# Altium project X2E Reference Sensor.PrjPcb (part 2 of 3)

## Sheet POWER.SchDoc: X2E Reference Sensor
size A3; PageSetup: Record=PageOptions|CenterHorizontal=True|CenterVertical=True|PrintScale=1.00|XCorrection=1.00|YCorrection=1.00|PrintKind=0|BorderSize=5000000|LeftOffset=0|BottomOffset=0|Orientation=2|PaperLength=1000|PaperWidth=1000|Scale=100|PaperSource=15|PrintQuality=600|MediaType=1|DitherType=10|PaperKind=Letter|PrintScaleMode=1; CompanyName: MatchX GmbH; Engineer: PSB; Organization: MatchX GmbH; DocumentNumber: 5; Revision: 1.2; SheetNumber: 5; SheetTotal: 9
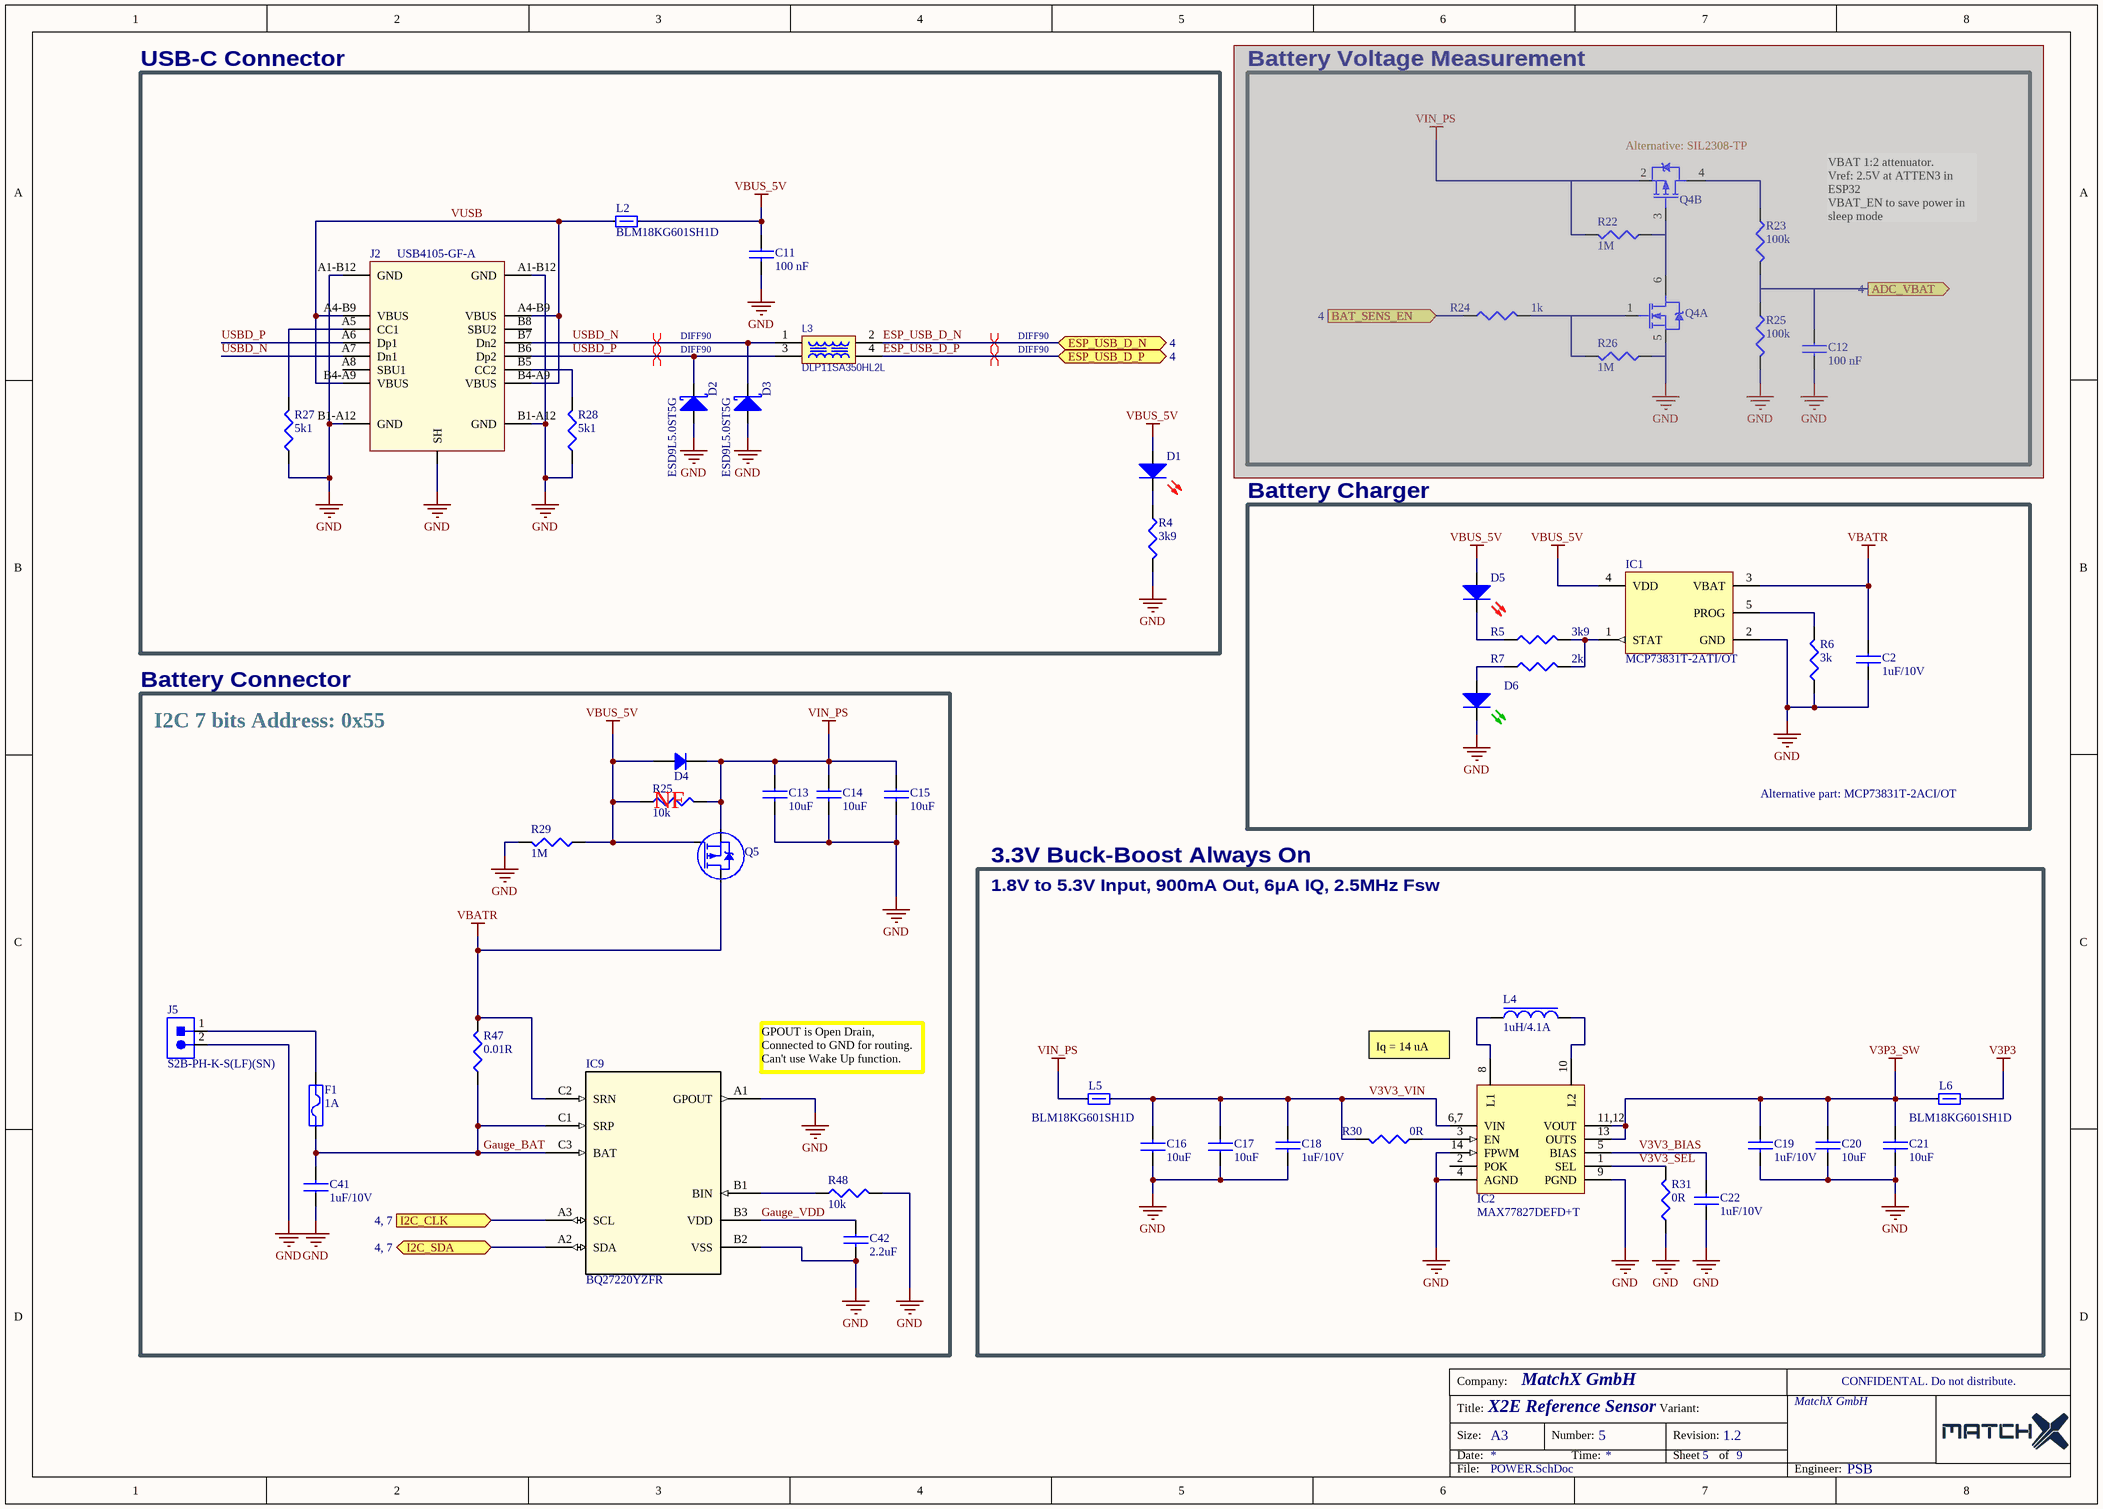
[diagram p6: POWER.SchDoc]

### Parts
(Parts that share a designator on the sheet are numbered #1, #2 ... from top to bottom, then left to right.)
C2  1uF/10V  [C0402]
C11  100 nF  [C0402]
C12  100 nF  [C0402]  (masked out: inside a compile mask, not in the netlist)
C13  10uF  [C0805]
C14  10uF  [C0805]
C15  10uF  [C0805]
C16  10uF  [C0805]
C17  10uF  [C0805]
C18  1uF/10V  [C0402]
C19  1uF/10V  [C0402]
C20  10uF  [C0805]
C21  10uF  [C0805]
C22  1uF/10V  [C0402]
C41  1uF/10V  [C0402]
C42  2.2uF  [C0402]
D1  150060RS75000  [LED0603]  (value not drawn)
D2  ESD9L5.0ST5G  [SOD-923]
D3  ESD9L5.0ST5G  [SOD-923]
D4  Diode_US1GWF-7  [sod123f]  (value not drawn)
D5  LTST-S270KRKT  [LED0603_RA]  (value not drawn)
D6  LTST-S270KGKT  [LED0603_RA]  (value not drawn)
F1  Current Rating: 1A  [F1206]  (hidden comment: FUSE-SF-1206S100-2)
IC1  MCP73831T-2ATI/OT  [SOT23-5]
IC2  MAX77827DEFD+T  [14-FC2QFN]
IC9  BQ27220YZFR  [IC_BQ27421YZFR-G1A]
J2  Manufacturer Part Number: USB4105-GF-A  [TYPE-CF-16P-RAT-L7.3]  (hidden comment: TYPE-CF-16P-RAT-L7.3)
J5  S2B-PH-K-S(LF)(SN)  [CON_S2B-PH-K-S]
L2  BLM18KG601SH1D  [L0603]
L3  DLP11SA350HL2L  [DLP11SA350HL2L]
L4  1uH/4.1A  [L252020]
L5  BLM18KG601SH1D  [L0603]
L6  BLM18KG601SH1D  [L0603]
Q4  DMC2700UDM-7  [SOT23-6]  (value not drawn)  (parts A,B of 2)  (masked out: inside a compile mask, not in the netlist)
Q5  IRLML6401TRPBF  [SOT-23]  (value not drawn)
R4  3k9  [R0603]
R5  3k9  [R0603]
R6  3k  [R0603]
R7  2k  [R0603]
R22#1  1M  [R0402]  (masked out: inside a compile mask, not in the netlist)
R23#2  100k  [R0402]  (masked out: inside a compile mask, not in the netlist)
R24#1  1k  [R0402]  (masked out: inside a compile mask, not in the netlist)
R25#1  100k  [R0402]  (masked out: inside a compile mask, not in the netlist)
R25#2  10k  [R0402]
R26#1  1M  [R0402]  (masked out: inside a compile mask, not in the netlist)
R27  5k1  [R0603]
R28  5k1  [R0603]
R29  1M  [R0402]
R30  0R  [R0402]
R31  0R  [R0402]
R47  0.01R  [R0805]
R48  10k  [R0402]

### Blocks framed on the sheet
USB-C Connector: C11 D1-D3 J2 L2 L3 R4 R27 R28
Battery Voltage Measurement: C12 Q4 R22#1 R23#2 R24#1 R25#1 R26#1
Battery Charger: C2 D5 D6 IC1 R5-R7
3.3V Buck-Boost Always On: C16-C22 IC2 L4-L6 R30 R31

### Ports
ADC_VBAT (out, see 4), BAT_SENS_EN (in, see 4), ESP_USB_D_N (bidir, see 4), ESP_USB_D_P (bidir, see 4), I2C_CLK (in, see 4, 7), I2C_SDA (bidir, see 4, 7)

### Nets
GND: C2.2 C11.2 C13.2 C14.2 C15.2 C16.1 C17.1 C18.2 C19.2 C20.2 C21.2 C22.1 C41.1 C42.2 D2.2(K) D3.2(K) D6.K IC1.2(GND) IC2.4(AGND) IC2.9(PGND) IC2.14(FPWM) IC9.A1(GPOUT) IC9.B2(VSS) J2.A1-B12(GND) J2.B1-A12(GND) J2.SH J5.2 R4.1 R6.1 R27.1 R28.1 R29.2 R31.1 R48.2
V3P3: L6.2
V3P3_SW: C19.1 C20.1 C21.1 IC2.11,12(VOUT) IC2.13(OUTS) L6.1
VBATR: C2.1 IC1.3(VBAT) IC9.C2(SRN) Q5.3(D) R47.2
VBUS_5V: C11.1 D1.A D4.1 D5.A IC1.4(VDD) L2.2 Q5.1(G) R25#2.1 R29.1
VIN_PS: C13.1 C14.1 C15.1 D4.2 L5.1 Q5.2(S) R25#2.2
ESP_USB_D_N: L3.2 ; port ESP_USB_D_N
ESP_USB_D_P: L3.4 ; port ESP_USB_D_P
Gauge_BAT: C41.2 F1.2 IC9.C1(SRP) IC9.C3(BAT) R47.1
Gauge_VDD: C42.1 IC9.B3(VDD)
I2C_CLK: IC9.A3(SCL) ; port I2C_CLK
I2C_SDA: IC9.A2(SDA) ; port I2C_SDA
USBD_N: D3.1(A) J2.A7(Dn1) J2.B7(Dn2) L3.1
USBD_P: D2.1(A) J2.A6(Dp1) J2.B6(Dp2) L3.3
V3V3_BIAS: C22.2 IC2.5(BIAS)
V3V3_SEL: IC2.1(SEL) R31.2
V3V3_VIN: C16.2 C17.2 C18.1 IC2.6,7(VIN) L5.2 R30.2
VUSB: J2.A4-B9(VBUS) J2.B4-A9(VBUS) L2.1
NetD1_K: D1.K R4.2
NetD5_K: D5.K R5.2
NetD6_A: D6.A R7.2
NetF1_1: F1.1 J5.1
NetIC1_1: IC1.1(STAT) R5.1 R7.1
NetIC1_5: IC1.5(PROG) R6.2
NetIC2_3: IC2.3(EN) R30.1
NetIC2_8: IC2.8(L1) L4.1
NetIC2_10: IC2.10(L2) L4.2
NetIC9_B1: IC9.B1(BIN) R48.1
NetJ2_A5: J2.A5(CC1) R27.2
NetJ2_B5: J2.B5(CC2) R28.2

Not connected (* = marked no-connect by the designer): IC2 2(POK); J2 A8(SBU1) B8(SBU2)

### Layout directives
differential pair; differential pair class DIFF90; net class DIFF90: ESP_USB_D_N, ESP_USB_D_P, USBD_N, USBD_P

### Notes on the sheet
- (near Q4) Alternative: SIL2308-TP
- VBAT 1:2 attenuator.
  Vref: 2.5V at ATTEN3 in ESP32
  VBAT_EN to save power in sleep mode
- Battery Connector
- I2C 7 bits Address: 0x55
- Alternative part: MCP73831T-2ACI/OT
- 1.8V to 5.3V Input, 900mA Out, 6μA IQ, 2.5MHz Fsw
- Iq = 14 uA
- (near IC9) GPOUT is Open Drain,
  Connected to GND for routing.
  Can't use Wake Up function.
- Company:
- CONFIDENTAL. Do not distribute.
- Title:
- Size:
- Date:
- A3
- Number:
- Time:
- Variant:
- Revision:
- Sheet
- of
- File:
- Engineer:

### Library data of the parts
C2 C18 C19 C22 C41 = C0402-1uF_10V: CAP, CERM, 1 uF, 10V, +/- 10%, X5R, 0402; Manufacturer Part Number: C0402C105M8PACTU; CompType: Capacitor; Category: Capacitors; Operating Temperature: -55°C ~ 85°C; Package / Case: 0402; RoHS: RoHS Compliant; Temperature Coefficient: X5R; Tolerance: 10%; Voltage - Rated: 10V; MountType: SMT; Technology: Ceramic; Value: 1uF/10V
C11 C12 = C0402-100nF_50V: CAP, CERM, 100 nF, 50V, +/- 10%, X7R, 0402; Manufacturer Part Number: GRM155R71H104KE14J; CompType: Capacitor; Category: Capacitors; Operating Temperature: -55°C ~ 125°C; Package / Case: 0402; RoHS: RoHS Compliant; Temperature Coefficient: X7R; Tolerance: 10%; Voltage - Rated: 50 V; MountType: SMT; Technology: Ceramic; Value: 100 nF
C13-C17 C20 C21 = C0805-10uF_16V: CAP, CERM, 10uF, 16V, +/- 20%, X5R, 0805; Manufacturer Part Number: GRM21BR61C106KE15L; CompType: Capacitor; Category: Capacitors; Operating Temperature: -55°C ~ 85°C; Package / Case: 0805 (2012 Metric); RoHS: RoHS Compliant; Temperature Coefficient: X5R; Tolerance: 20%; Voltage - Rated: 16 V; MountType: SMT; Technology: Ceramic; Value: 10uF
C42 = C0402-2.2uF/10V: CAP, CERM, 2.2uF, 10V, +/- 10%, X5R, 0402; Manufacturer Part Number: GRM155R61A225KE01D; CompType: Capacitor; Category: Capacitors; Operating Temperature: -55°C ~ 85°C; Package / Case: 0402; RoHS: RoHS Compliant; Temperature Coefficient: X5R; Tolerance: 10%; Voltage - Rated: 10V; MountType: SMT; Technology: Ceramic; Value: 2.2uF
D1 = LED_RED_0603: Red 625nm LED Indication - Discrete 2V 0603 (1608 Metric); Manufacturer: Wurth Electronics; Wavelength - Peak: 630nm; Millicandela Rating: 250mcd; Current - Test: 20mA; Viewing Angle: 140°; Lens Style/Size: Rectangle with Flat Top, 1.1mm x 0.7mm; 3D Model: SMCW_0603.igs / SMCW_0603.stp / SMCW_0603.wrl; Lens Type: Clear; Dynamic Catalog: 0603 Rectangle with Flat Top Chip LEDs; Other Names: 732-4978-6; Supplier 1: Digikey; Manufacturer Part Number: 150060RS75000; Stock 1: 11457; Pricing 1: 1=0.14, 50=0.129, 100=0.11, 500=0.095 (USD); ComponentLink1URL: https://datasheet.ciiva.com/29563/150060rs75000-29563040.pdf; ComponentLink1Description: https://datasheet.ciiva.com/29563/150060rs75000-29563040.pdf; Category: Optoelectronics; Packaging: Digi-Reel®; Color: Red; Wavelength - Dominant: 625nm; Voltage - Forward (Vf) (Typ): 2V; Package / Case: 0603 (1608 Metric); Size / Dimension: 1.60mm L x 0.80mm W; Mounting Type: Surface Mount; ComponentLink2URL: https://datasheet.ciiva.com/29279/759428-da-01-en-chipled-0603-w-kl-rot-150060rs75000-29279196.pdf; ComponentLink2Description: https://datasheet.ciiva.com/29279/759428-da-01-en-chipled-0603-w-kl-rot-150060rs75000-29279196.pdf; Supplier Part Number 1: 732-4978-6-ND; Standard Package: 1; Family: LED Indication - Discrete; Series: WL-SMCW; Height: 0.70mm; Luminous Flux @ Current - Test: -
D2 D3 = TVSUni_ESD9L5.0ST5G: TVS DIODE 5V 9.8V SOD923; Manufacturer: ON Semiconductor; Capacitance: 0.9pF; Direction: Unidirectional; Number of Unidirectional Channels: 1; Min Breakdown Voltage: 5.4V; Power Line Protection: No; Leakage Current: 1uA; Element Configuration: Single; Peak Pulse Current: 1A; Reverse Breakdown Voltage: 5.8V; Peak Pulse Power: 150mW; ESD Protection: Yes; Test Current: 1mA; Supplier 1: Digi-Key; Supplier Part Number 1: ESD9L5.0ST5GOSCT-ND; Manufacturer Part Number: ESD9L5.0ST5G; Stock 1: 56991; Pricing 1: 1=0,36000, 10=0,29700, 100=0,15730, 500=0,10350, 1000=0,07038 (USD); RoHS: Yes; Case/Package: SOD-923-2; Number of Pins: 2; Contact Plating: Tin,Matte; Min Operating Temperature: -55°C; Max Operating Temperature: 150°C; Package Quantity: 1; Packaging: Tape and Reel; Clamping Voltage: 9.8V; Reverse Standoff Voltage: 5V; Working Voltage: 5V; Composition: Zener; Number of Elements: 1; Operating Supply Voltage: 5V; Max Surge Current: 1A; Breakdown Voltage: 5.4V; Number of Channels: 1; Polarity: Unidirectional; Termination: SMD/SMT; Max Reverse Leakage Current: 1uA; Max Breakdown Voltage: 5.4V; Number of Lines: 1; Power Dissipation: 150mW; Length: 0.8mm; Height: 0.4mm; Depth: 0.6mm; Width: 0.65mm; Radiation Hardening: No; Lead Free: Lead Free; REACH SVHC: No SVHC; Halogen Free: Halogen Free; ComponentLink1URL: https://datasheet.ciiva.com/15143/getdatasheetpartid-185186-15143896.pdf?src-supplier=Verical; ComponentLink1Description: https://datasheet.ciiva.com/15143/getdatasheetpartid-185186-15143896.pdf?src-supplier=Verical; ComponentLink2URL: https://datasheet.ciiva.com/4510/esd9l-d-4510647.pdf?src-supplier=Mouser; ComponentLink2Description: https://datasheet.ciiva.com/4510/esd9l-d-4510647.pdf?src-supplier=Mouser; ComponentLink3URL: https://datasheet.ciiva.com/3304/esd9l-d-3304011.pdf?src-supplier=Avnet; ComponentLink3Description: https://datasheet.ciiva.com/3304/esd9l-d-3304011.pdf?src-supplier=Avnet; ComponentLink4URL: https://datasheet.ciiva.com/16437/esd9l-d-16437835.pdf?src-supplier=Future+Electronics; ComponentLink4Description: https://datasheet.ciiva.com/16437/esd9l-d-16437835.pdf?src-supplier=Future+Electronics; ComponentLink5URL: https://datasheet.ciiva.com/339/esd9l-d-339853.pdf?src-supplier=Digi-Key; ComponentLink5Description: https://datasheet.ciiva.com/339/esd9l-d-339853.pdf?src-supplier=Digi-Key; ComponentLink6URL: https://datasheet.ciiva.com/339/esd9l-d-339854.pdf?src-supplier=Digi-Key; ComponentLink6Description: https://datasheet.ciiva.com/339/esd9l-d-339854.pdf?src-supplier=Digi-Key; ComponentLink7URL: https://datasheet.ciiva.com/11195/esd9l-d-11195342.pdf?src-supplier=Avnet; ComponentLink7Description: https://datasheet.ciiva.com/11195/esd9l-d-11195342.pdf?src-supplier=Avnet; ComponentLink8URL: https://datasheet.ciiva.com/25958/esd9l-d-25958446.pdf?src-supplier=Avnet+Europe; ComponentLink8Description: https://datasheet.ciiva.com/25958/esd9l-d-25958446.pdf?src-supplier=Avnet+Europe; ComponentLink9URL: https://datasheet.ciiva.com/339/esd9l-d-339855.pdf?src-supplier=Digi-Key; ComponentLink9Description: https://datasheet.ciiva.com/339/esd9l-d-339855.pdf?src-supplier=Digi-Key
D4 = Diode_US1GWF-7: DIODE GEN PURP 400V 1A SOD123F; Manufacturer: Diodes Incorporated; Capacitance @ Vr, F: 9pF @ 4V, 1MHz; Voltage - Forward (Vf) (Max) @ If: 1.25 V @ 1 A; Diode Type: Standard; Manufacturer Part Number: US1GWF-7; Voltage - DC Reverse (Vr) (Max): 400 V; Supplier Device Package: SOD-123F; Supplier Part Number 1: US1GWF-7DICT-ND; Package / Case: SOD-123F; Operating Temperature - Junction: -55°C ~ 150°C
D5 = LED_RED_0603_RA: LED Low-Power Uni-Color Red 639nm 2V 2-Pin Chip LED T/R; Manufacturer: Vishay Lite-On; Viewing Angle: 130°; Lens Color: Colorless; Forward Current: 30mA; Luminous Intensity: 54mcd; Lens Style: Flat,Diffused,Colorless,Rectangular,Clear; Power Rating: 75mW; Dominant Wavelength: 631nm; Test Current: 20mA; Lens Transparency: Clear; Number of Elements: 1; Reverse Voltage: 5V; Lens Size: 0.6mm; Supplier 1: Digikey; Manufacturer Part Number: LTST-S270KRKT; Stock 1: 148097; Pricing 1: 1=0,24, 10=0,133, 100=0,0617, 500=0,05696, 1000=0,04462, 2000=0,04367 (USD); ComponentLink1URL: https://datasheet.ciiva.com/11775/0900766b80dc0b8e-11775445.pdf?src-supplier=Rs; ComponentLink1Description: https://datasheet.ciiva.com/11775/0900766b80dc0b8e-11775445.pdf?src-supplier=Rs; Category: LEDs; Packaging: Tape and Reel; Color: Red; ComponentLink2URL: https://datasheet.ciiva.com/12400/ltst-s270krkt-201849-12400833.pdf?src-supplier=Mouser; ComponentLink2Description: https://datasheet.ciiva.com/12400/ltst-s270krkt-201849-12400833.pdf?src-supplier=Mouser; Supplier Part Number 1: 160-1479-1-ND; Series: -; Height: 0.6mm; RoHS: Yes; Mount: Surface Mount; Case/Package: 0603; Number of Pins: 2; Case Code (Metric): 1608; Case Code (Imperial): 0603; Min Operating Temperature: -55°C; Max Operating Temperature: 85°C; Forward Voltage: 2V; Package Quantity: 4000; Illumination Color: Red; Power Dissipation: 75mW; Wavelength: 639nm; Number of LEDs: 1; Max Power Dissipation: 75mW; Length: 1.6mm; Width: 1.15mm; Depth: 0.6mm; Radiation Hardening: No; Lead Free: Lead Free; RoHS Compliant: Yes; ComponentLink3URL: https://datasheet.ciiva.com/2110/ltst-s270krkt-2110021.pdf?src-supplier=Digikey; ComponentLink3Description: https://datasheet.ciiva.com/2110/ltst-s270krkt-2110021.pdf?src-supplier=Digikey; ComponentLink4URL: https://datasheet.ciiva.com/16387/p-100-ltst-s270krkt-16387507.pdf?src-supplier=Future+Electronics; ComponentLink4Description: https://datasheet.ciiva.com/16387/p-100-ltst-s270krkt-16387507.pdf?src-supplier=Future+Electronics; ComponentLink5URL: https://datasheet.ciiva.com/2110/s-110-ltst-s270krkt-2110023.pdf?src-supplier=Digikey; ComponentLink5Description: https://datasheet.ciiva.com/2110/s-110-ltst-s270krkt-2110023.pdf?src-supplier=Digikey; ComponentLink6URL: https://datasheet.ciiva.com/2110/s-110-ltst-s270krkt-2110022.pdf?src-supplier=Digikey; ComponentLink6Description: https://datasheet.ciiva.com/2110/s-110-ltst-s270krkt-2110022.pdf?src-supplier=Digikey
D6 = LED_GREEN_0603_RA: LED GREEN CLEAR 0603 R/A SMD / LED Uni-Color Green 574nm 2-Pin Chip LED T/R; Manufacturer: Vishay Lite-On; Viewing Angle: 130°; Lens Color: Colorless; Forward Current: 30mA; Forward Voltage: 2V; Power Rating: 75mW; Luminous Intensity: 71mcd; Lens Style: Flat,Diffused,Colorless,Rectangular,Clear; Dominant Wavelength: 571nm; Test Current: 20mA; Number of Elements: 1; Reverse Voltage: 5V; Lens Size: 0.6mm; Supplier 1: Digikey; Manufacturer Part Number: LTST-S270KGKT; Stock 1: 117112; Pricing 1: 1=0,24, 10=0,133, 100=0,0617, 500=0,05696, 1000=0,04462, 2000=0,04367 (USD); ComponentLink1URL: https://datasheet.ciiva.com/2110/ltst-s270kgkt-2110006.pdf?src-supplier=Digikey; ComponentLink1Description: https://datasheet.ciiva.com/2110/ltst-s270kgkt-2110006.pdf?src-supplier=Digikey; Category: LEDs; Packaging: Tape and Reel; Color: Green; ComponentLink2URL: https://datasheet.ciiva.com/11774/0900766b80dc0b88-11774745.pdf?src-supplier=Rs; ComponentLink2Description: https://datasheet.ciiva.com/11774/0900766b80dc0b88-11774745.pdf?src-supplier=Rs; Supplier Part Number 1: 160-1478-1-ND; Series: -; Height: 0.6mm; ComponentLink3URL: https://datasheet.ciiva.com/12400/ltst-s270kgkt-201847-12400865.pdf?src-supplier=Mouser; ComponentLink3Description: https://datasheet.ciiva.com/12400/ltst-s270kgkt-201847-12400865.pdf?src-supplier=Mouser; ComponentLink4URL: https://datasheet.ciiva.com/4266/dwonloadfilehandler-ashxtxtspecnods222000226-4266440.pdf?src-supplier=Arrow+Electronics; ComponentLink4Description: https://datasheet.ciiva.com/4266/dwonloadfilehandler-ashxtxtspecnods222000226-4266440.pdf?src-supplier=Arrow+Electronics; RoHS: Yes; Mount: Surface Mount; Case/Package: 0603; Number of Pins: 2; Case Code (Metric): 1608; Case Code (Imperial): 0603; Min Operating Temperature: -55°C; Max Operating Temperature: 85°C; Illumination Color: Green; Package Quantity: 4000; Lens Transparency: Clear; Power Dissipation: 75mW; Number of LEDs: 1; Wavelength: 574nm; Length: 1.6mm; Width: 1.15mm; Depth: 0.6mm; Radiation Hardening: No; RoHS Compliant: Yes; Lead Free: 5697LeadFree; ComponentLink5URL: https://datasheet.ciiva.com/2110/s-110-ltst-s270kgkt-2110007.pdf?src-supplier=Digikey; ComponentLink5Description: https://datasheet.ciiva.com/2110/s-110-ltst-s270kgkt-2110007.pdf?src-supplier=Digikey; ComponentLink6URL: https://datasheet.ciiva.com/2110/s-110-ltst-s270kgkt-2110008.pdf?src-supplier=Digikey; ComponentLink6Description: https://datasheet.ciiva.com/2110/s-110-ltst-s270kgkt-2110008.pdf?src-supplier=Digikey; ComponentLink7URL: https://datasheet.ciiva.com/16448/ltst-s270kgkt-16448566.pdf?src-supplier=Future+Electronics; ComponentLink7Description: https://datasheet.ciiva.com/16448/ltst-s270kgkt-16448566.pdf?src-supplier=Future+Electronics
F1 = FUSE-SF-1206S100-2: Fuse Chip Slow Blow Acting 1A 63V SMD Solder Pad 1206 T/R UL; Manufacturer: Bourns; Fuse Type: Board Mount (Cartridge Style Excluded); DC Cold Resistance: 108mR; Body Material: Ceramic; Value: 108mR; Fuse Size: 3.1 X 1.55 X 0.6mm; Supplier 1: Digi-Key; Manufacturer Part Number: SF-1206S100-2; RoHS: Yes; Category: Fuses; Case/Package: 1206; Case Code (Imperial): 1206; Case Code (Metric): 3216; Min Operating Temperature: -20°C; Max Operating Temperature: 105°C; Packaging: Tape and Reel; Voltage Rating (DC): 63V; Approvals: UL; RoHS Compliant: Yes; ComponentLink1URL: https://datasheet.ciiva.com/4484/sf1206s-76698-4484241.pdf?src-supplier=Mouser; ComponentLink1Description: https://datasheet.ciiva.com/4484/sf1206s-76698-4484241.pdf?src-supplier=Mouser; ComponentLink2URL: https://datasheet.ciiva.com/41439/001056288-da-01-en-sich-langs-sf-1206s100-2-63vdc-1a-41439375.pdf?src-supplier=Conrad; ComponentLink2Description: https://datasheet.ciiva.com/41439/001056288-da-01-en-sich-langs-sf-1206s100-2-63vdc-1a-41439375.pdf?src-supplier=Conrad; Supplier Part Number 1: SF-1206S100-2CT-ND; Mounting Technology: Surface Mount; Pins: 2; Terminal Material: Copper; Package Quantity: 10000; Voltage Rating: 63V; Max Voltage Rating (DC): 63V; Termination: SMD/SMT; Fuse Current: 1A; Series: SinglFuse™ SF-1206S; Primary Type: Chip; Length: 3.1mm; Width: 1.55mm; Height: 0.6mm; Depth: 1.55mm; Reach SVHC Compliant: No; ComponentLink3URL: https://datasheet.ciiva.com/300/sf1206s-300864.pdf?src-supplier=Digi-Key; ComponentLink3Description: https://datasheet.ciiva.com/300/sf1206s-300864.pdf?src-supplier=Digi-Key; ComponentLink4URL: https://datasheet.ciiva.com/300/sf1206s-300865.pdf?src-supplier=Digi-Key; ComponentLink4Description: https://datasheet.ciiva.com/300/sf1206s-300865.pdf?src-supplier=Digi-Key; ComponentLink5URL: https://datasheet.ciiva.com/3018/sf1206s-3018194.pdf?src-supplier=Avnet; ComponentLink5Description: https://datasheet.ciiva.com/3018/sf1206s-3018194.pdf?src-supplier=Avnet; ComponentLink6URL: https://datasheet.ciiva.com/7991/1727895-7991989.pdf?src-supplier=Element14; ComponentLink6Description: https://datasheet.ciiva.com/7991/1727895-7991989.pdf?src-supplier=Element14; ComponentLink7URL: https://datasheet.ciiva.com/22641/1727895-22641222.pdf?src-supplier=Element14; ComponentLink7Description: https://datasheet.ciiva.com/22641/1727895-22641222.pdf?src-supplier=Element14; ComponentLink8URL: https://datasheet.ciiva.com/28413/1727895-28413558.pdf?src-supplier=Element14; ComponentLink8Description: https://datasheet.ciiva.com/28413/1727895-28413558.pdf?src-supplier=Element14; ComponentLink9URL: https://datasheet.ciiva.com/14540/70154750-14540087.pdf?src-supplier=Allied+Electronics; ComponentLink9Description: https://datasheet.ciiva.com/14540/70154750-14540087.pdf?src-supplier=Allied+Electronics; ComponentLink10URL: https://datasheet.ciiva.com/16213/sf1206s-16213288.pdf?src-supplier=Onlinecomponents.com; ComponentLink10Description: https://datasheet.ciiva.com/16213/sf1206s-16213288.pdf?src-supplier=Onlinecomponents.com; ComponentLink11URL: https://datasheet.ciiva.com/30176/1104sf1206s-30176040.pdf?src-supplier=Onlinecomponents.com; ComponentLink11Description: https://datasheet.ciiva.com/30176/1104sf1206s-30176040.pdf?src-supplier=Onlinecomponents.com; ComponentLink12URL: https://datasheet.ciiva.com/11337/sf1206s-11337865.pdf?src-supplier=Avnet; ComponentLink12Description: https://datasheet.ciiva.com/11337/sf1206s-11337865.pdf?src-supplier=Avnet; ComponentLink13URL: https://datasheet.ciiva.com/32431/sf-1206s-series-eng-tds-32431275.pdf?src-supplier=Distrelec; ComponentLink13Description: https://datasheet.ciiva.com/32431/sf-1206s-series-eng-tds-32431275.pdf?src-supplier=Distrelec; ComponentLink14URL: https://datasheet.ciiva.com/300/sf1206s-300863.pdf?src-supplier=Digi-Key; ComponentLink14Description: https://datasheet.ciiva.com/300/sf1206s-300863.pdf?src-supplier=Digi-Key
IC1 = MCHIP=MCP73831T-2ATI/OT: IC CONTROLLR LI-ION 4.2V SOT23-5; Manufacturer: Microchip; Output Current: 500mA; Min Supply Voltage: 3.75V; Max Supply Voltage: 6V; Number of Cells: 1; Max Output Voltage: 4.232V; Min Output Voltage: 4.168V; Supplier 1: Digi-Key; Supplier Part Number 1: MCP73831T-2ATI/OTCT-ND; Manufacturer Part Number: MCP73831T-2ATI/OT; Stock 1: 16216; Pricing 1: 1=0,56000, 25=0,47000, 100=0,42000 (USD); RoHS: Yes; Mount: Surface Mount; Case/Package: SOT-23; Number of Pins: 5; Min Operating Temperature: -40°C; Max Operating Temperature: 85°C; Output Voltage: 4.2V; Packaging: Tape and Reel; Package Quantity: 3000; Max Output Current: 500mA; Max Charge Current: 500mA; Length: 3.1mm; Height: 1.3mm; Width: 1.8mm; REACH SVHC: No SVHC; Lead Free: Lead Free; ComponentLink1URL: https://datasheet.ciiva.com/26344/651522-da-01-en-contr-mcp73831t-2ati-ot-sot-23-5-mcp-26344457.pdf?src-supplier=Conrad; ComponentLink1Description: https://datasheet.ciiva.com/26344/651522-da-01-en-contr-mcp73831t-2ati-ot-sot-23-5-mcp-26344457.pdf?src-supplier=Conrad; ComponentLink2URL: https://datasheet.ciiva.com/1931/21984e-1931956.pdf?src-supplier=Digi-Key; ComponentLink2Description: https://datasheet.ciiva.com/1931/21984e-1931956.pdf?src-supplier=Digi-Key; ComponentLink3URL: https://datasheet.ciiva.com/1931/21984e-1931958.pdf?src-supplier=Digi-Key; ComponentLink3Description: https://datasheet.ciiva.com/1931/21984e-1931958.pdf?src-supplier=Digi-Key; ComponentLink4URL: https://datasheet.ciiva.com/1137/630369-1137804.pdf?src-supplier=Element14; ComponentLink4Description: https://datasheet.ciiva.com/1137/630369-1137804.pdf?src-supplier=Element14; ComponentLink5URL: https://datasheet.ciiva.com/8039/630369-8039388.pdf?src-supplier=Element14; ComponentLink5Description: https://datasheet.ciiva.com/8039/630369-8039388.pdf?src-supplier=Element14; ComponentLink6URL: https://datasheet.ciiva.com/16217/filehandler-aspxddocname-en025112-16217052.pdf?src-supplier=Future+Electronics; ComponentLink6Description: https://datasheet.ciiva.com/16217/filehandler-aspxddocname-en025112-16217052.pdf?src-supplier=Future+Electronics; ComponentLink7URL: https://datasheet.ciiva.com/1931/21984e-1931957.pdf?src-supplier=Digi-Key; ComponentLink7Description: https://datasheet.ciiva.com/1931/21984e-1931957.pdf?src-supplier=Digi-Key; ComponentLink8URL: https://datasheet.ciiva.com/17299/21984e-17299304.pdf?src-supplier=Avnet+Europe; ComponentLink8Description: https://datasheet.ciiva.com/17299/21984e-17299304.pdf?src-supplier=Avnet+Europe; ComponentLink9URL: https://datasheet.ciiva.com/3213/21984e-3213405.pdf?src-supplier=Avnet; ComponentLink9Description: https://datasheet.ciiva.com/3213/21984e-3213405.pdf?src-supplier=Avnet
IC2 = Maxim=MAX77827DEFD+T: DC to DC Converter Buck-Boost 2.6V 1.6A 12-Pin WLP T/R; Manufacturer: Maxim; Supplier 1: Mouser; Manufacturer Part Number: MAX77827DEFD+T; RoHS: Yes; Category: Voltage Regulators - Switching; Stock 1: 3255; Pricing 1: 1=1.74000, 10=1.57000, 50=1.48000, 100=1.26000, 1000=0.88500, 10000=0.85500 (USD); Supplier Part Number 1: 700-MAX77827DEFD+T
IC9 = BQ27220YZFR: Single cell pack/system-side CEDV battery fuel (gas) gauge w/pre-programmed chemistry profiles 9-DSBGA -40 to 85; Manufacturer: Texas Instruments; Number of Cells: 1; Interface: I2C; Battery Chemistry: LITHIUM-ION; Supplier 1: Digi-Key; RoHS: Yes; Category: Battery Management; Stock 1: 7613; Pricing 1: 1=1,64, 10=1,463, 25=1,3888, 100=1,1408, 250=1,06644, 500=0,94244, 1000=0,74402 (USD); Mounting Technology: Surface Mount; Pins: 9; Min Operating Temperature: -40°C; Max Operating Temperature: 85°C; Packaging: Tape and Reel; Series: -; Lead Free: Lead Free; RoHS Compliant: Yes; ComponentLink1URL: http://www.ti.com/lit/pdf/sluubd4?src-supplier=Digi-Key; ComponentLink1Description: http://www.ti.com/lit/pdf/sluubd4?src-supplier=Digi-Key; ComponentLink2URL: http://www.ti.com/general/docs/suppproductinfo.tsp?distId=10&amp;gotoUrl=http%3A%2F%2Fwww.ti.com%2Flit%2Fgpn%2Fbq27220&src-supplier=Digi-Key; ComponentLink2Description: http://www.ti.com/general/docs/suppproductinfo.tsp?distId=10&amp;gotoUrl=http%3A%2F%2Fwww.ti.com%2Flit%2Fgpn%2Fbq27220&src-supplier=Digi-Key; Supplier Part Number 1: 296-47202-1-ND; Manufacturer Part Number: BQ27220YZFR
J2 = TYPE-CF-16P-RAT-L7.3: Conn USB 2.0 Type C RCP 24 POS 0.3mm/0.5mm Solder RA SMD 24 Terminal 1 Port T/R; Manufacturer: Global Connector Technology; Current Rating: 5A; Voltage: 100 VAC; Supplier 1: Farnell; RoHS: No; Category: USB Connectors; Minimum Operating Temperature: -30 °C; Maximum Operating Temperature: 85 °C
J5 = CON_S2B-PH-K-S(LF)(SN): CONN HEADER R/A 2POS 2MM; Manufacturer: JST; Current Rating: 2A; Contact Resistance: 20mR; Voltage Rating: 100V; Number of Positions: 2; Gender: Male; Connector Type: Male Pin; Insulation Resistance: 1GR; Supplier 1: Digi-Key; Supplier Part Number 1: 455-1719-ND; Manufacturer Part Number: S2B-PH-K-S(LF)(SN); RoHS: Yes; Category: Headers and Wire Housings; Stock 1: 96334; Pricing 1: 1=0,170000, 10=0,161000, 100=0,099100, 500=0,082020, 1000=0,071770, 5000=0,061520, 10000=0,059810 (USD); Mount: Through Hole; Number of Pins: 2; Contact Material: Tin,Brass,Bronze; Contact Plating: Tin,Copper; Color: Natural,White; Housing Color: White; Housing Material: Polyamide; Min Operating Temperature: -25°C; Max Operating Temperature: 85°C; Max Current Rating: 2A; Number of Rows: 1; Packaging: Bulk; Termination: Solder; Fastening Type: Detent; Number of Contacts: 2; Max Voltage Rating (AC): 100V; Orientation: Right Angle; Number of Poles: 2; Voltage Rating (AC): 100V; Max Voltage Rating (DC): 100V; Working Voltage: 100V; Length: 5.9mm; Height: 9.4mm; Pitch: 2mm; Width: 4.5mm; Contact Mating Length: 0.13inch; Depth: 7.6mm; Lead Pitch: 2mm; REACH SVHC: No SVHC; Lead Free: Lead Free; Flammability Rating: UL94 V-0; ComponentLink1URL: https://datasheet.ciiva.com/11747/0900766b8082f558-11747128.pdf?src-supplier=RSComponents; ComponentLink1Description: https://datasheet.ciiva.com/11747/0900766b8082f558-11747128.pdf?src-supplier=RSComponents; ComponentLink2URL: https://datasheet.ciiva.com/16484/s2b-ph-k-slfsn-16484405.pdf?src-supplier=Future+Electronics; ComponentLink2Description: https://datasheet.ciiva.com/16484/s2b-ph-k-slfsn-16484405.pdf?src-supplier=Future+Electronics; ComponentLink3URL: https://datasheet.ciiva.com/8052/80564-8052207.pdf?src-supplier=Element14; ComponentLink3Description: https://datasheet.ciiva.com/8052/80564-8052207.pdf?src-supplier=Element14; ComponentLink4URL: https://datasheet.ciiva.com/26894/getdatasheetpartid-641020-26894599.pdf?src-supplier=Verical; ComponentLink4Description: https://datasheet.ciiva.com/26894/getdatasheetpartid-641020-26894599.pdf?src-supplier=Verical; ComponentLink5URL: https://datasheet.ciiva.com/712/eph-712447.pdf?src-supplier=Digi-Key; ComponentLink5Description: https://datasheet.ciiva.com/712/eph-712447.pdf?src-supplier=Digi-Key
L2 L5 L6 = BLM18KG601SH1D: Ferrite Beads 0603 600ohms 1.3A DCR=.15ohms; Manufacturer: Murata Electronics North America; Filter Type: Power Line; Number of Lines: 1; Impedance @ Frequency: 600 Ohm @ 100MHz; DC Resistance (DCR) (Max): 150 mOhm; Supplier 1: Digi-Key; Supplier Part Number 1: 490-13259-1-ND; Manufacturer Part Number: BLM18KG601SH1D; Stock 1: 5830; Pricing 1: 1=0.11, 10=0.088, 50=0.058, 100=0.0502, 250=0.0396, 500=0.03344, 1000=0.02816 (USD); Category: Filters; Packaging: Cut Tape (CT); Current Rating (Max): 1.3A; Ratings: AEC-Q200; Operating Temperature: -55°C ~ 125°C; Package / Case: 0603 (1608 Metric); Mounting Type: Surface Mount; Height (Max): 0.037" (0.95mm); Size / Dimension: 0.063" L x 0.032" W (1.60mm x 0.80mm); ComponentLink1URL: http://www.murata.com/en-global/products/productdata/8796737273886/QNFA9101.pdf; ComponentLink1Description: http://www.murata.com/en-global/products/productdata/8796737273886/QNFA9101.pdf; RoHS: RoHS Compliant
L3 = DLP11SA350HL2L: Common Mode Filters / Chokes 35Ohm 20% 100MHz; Manufacturer: Murata Electronics; Maximum DC Current: 170 mA; Maximum DC Resistance: 900 mOhms; Type: Common Mode Choke Coil Film Type; Case Height: 0.82 mm; Case Length: 1.25 mm; Case Width: 1 mm; Supplier 1: Mouser; Manufacturer Part Number: DLP11SA350HL2L; RoHS: RoHS Compliant; Category: Common Mode Filters / Chokes; Stock 1: 3163; Pricing 1: 1=0.787, 10=0.564, 100=0.399, 1000=0.382, 3000=0.270, 9000=0.261, 24000=0.252, 45000=0.244 (AUD); Operating Temperature Range: - 40 C to + 85 C; Package / Case: 0504 (1210 metric); Packaging: Reel; Product: Common Mode Filters; Series: DLP; Termination Style: SMD/SMT; Tolerance: 20 %; Brand: Murata Electronics; Standard Pack Qty: 3000; Tradename: EMIFIL; RoHS - Mouser: Y; Minimum Order Quantity: 1; Reeling: True; ComponentLink1URL: http://www.mouser.com/ds/2/281/Murata DL_PL Series-202927.pdf; ComponentLink1Description: http://www.mouser.com/ds/2/281/Murata DL_PL Series-202927.pdf; Supplier Part Number 1: 81-DLP11SA350HL2L; Value: DLP11SA350HL2L
L4 = L_BDHE002520121R0MQ1: FIXED IND 1UH 4.1A 42 MOHM SMD; Manufacturer: Pulse; Value: 1uH/4.1A; Supplier 1: Digi-Key; Manufacturer Part Number: BDHE002520121R0MQ1; RoHS: No; Stock 1: 5984; Pricing 1: 1=0.21000, 10=0.18700, 25=0.16640, 50=0.14160, 100=0.12490, 250=0.11452, 500=0.10410, 1000=0.08745 (USD); Supplier Part Number 1: 553-BDHE002520121R0MQ1CT-ND
Q4 = Diodes=DMC2700UDM-7: Trans MOSFET N/P-CH 20V 1.34A/1.14A Automotive 6-Pin SOT-26 T/R; Manufacturer: Diodes; Turn-On Delay Time: 5.1ns; Gate to Source Voltage (Vgs): 6V; Rds On Max: 400mR; Input Capacitance: 60.67pF; Continuous Drain Current (ID): 1.14A; Max Power Dissipation: 1.12W; Turn-Off Delay Time: 28.4ns; Number of Elements: 2; Drain to Source Resistance: 1.3R; FET Type: N and P-Channel; Polarity: N-CHANNEL,P-CHANNEL; Supplier 1: Digi-Key; Manufacturer Part Number: DMC2700UDM-7; RoHS: Yes; Category: MOSFETs; Stock 1: 122900; Pricing 1: 1=0.44000, 10=0.32800, 100=0.18590, 500=0.12308, 1000=0.09437 (USD); Mount: Surface Mount; Case/Package: SOT-26; Number of Pins: 6; Min Operating Temperature: -55°C; Max Operating Temperature: 150°C; Package Quantity: 3000; Packaging: Tape and Reel; Drain to Source Voltage (Vdss): 20V; Power Dissipation: 1.12W; Number of Channels: 2; Drain to Source Breakdown Voltage: 20V; Series: -; Length: 3.1mm; Width: 1.7mm; Height: 1.3mm; Radiation Hardening: No; REACH SVHC: No SVHC; Lead Free: Lead Free; RoHS Compliant: Yes; ComponentLink1URL: https://datasheet.ciiva.com/928/dmc2700udm-928784.pdf?src-supplier=Digi-Key; ComponentLink1Description: https://datasheet.ciiva.com/928/dmc2700udm-928784.pdf?src-supplier=Digi-Key; ComponentLink2URL: https://datasheet.ciiva.com/13051/dmc2700udm-73200-13051769.pdf?src-supplier=Mouser; ComponentLink2Description: https://datasheet.ciiva.com/13051/dmc2700udm-73200-13051769.pdf?src-supplier=Mouser; Supplier Part Number 1: DMC2700UDM-7CT-ND
Q5 = PMOSFET_ IRLML6401PbF: MOSFET P-CH 12V 4.3A SOT-23; Manufacturer: Infineon Technologies Americas Corp.; FET Type: MOSFET P-Channel, Metal Oxide; FET Feature: Logic Level Gate, 1.8V Drive; Current - Continuous Drain (Id) @ 25°C: 4.3A (Ta); Rds On (Max) @ Id, Vgs: 50 mOhm @ 4.3A, 4.5V; Vgs(th) (Max) @ Id: 950mV @ 250µA; Gate Charge (Qg) @ Vgs: 15nC @ 5V; Input Capacitance (Ciss) @ Vds: 830pF @ 10V; Power - Max: 1.3W; Supplier 1: Digi-Key; Manufacturer Part Number: IRLML6401TRPBF; RoHS: RoHS Compliant; Category: Discrete Semiconductor Products; Stock 1: 171000; Pricing 1: 3000=0.1254, 6000=0.1178, 15000=0.1102, 30000=0.10108, 75000=0.09728, 150000=0.09348 (USD); Packaging: Tape & Reel (TR); Drain to Source Voltage (Vdss): 12V; Operating Temperature: -55°C ~ 150°C (TJ); Mounting Type: Surface Mount; Package / Case: TO-236-3, SC-59, SOT-23-3; Supplier Device Package: Micro3™/SOT-23; ComponentLink1URL: http://www.irf.com/product-info/datasheets/data/irlml6401pbf.pdf; ComponentLink1Description: http://www.irf.com/product-info/datasheets/data/irlml6401pbf.pdf; Supplier Part Number 1: IRLML6401PBFTR-ND
R4 R5 = R0603-3k9: RES, 3k9, 1%, 0.063 W, 0603; Power (Watts): 0.063W, 1/16W; .Checked PCB: OK RF; .Checked SCH: RF; Category: Resistors; Package / Case: 0603 [1608 Metric]; Tolerance: ±1%; Value: 3k9; RoHS: RoHS Compliant; Composition: Thick Film; Features: -; Size / Dimension: 0.063" L x 0.031" W (1.60mm x 0.80mm); Height: 0.016" (0.40mm); Number of Terminations: 2
R6 = R0603-3k: RES, 3k, 1%, 0.063 W, 0603; Manufacturer Part Number: AF0603FR-073KL; Power (Watts): 0.063W, 1/16W; .Checked PCB: OK RF; .Checked SCH: RF; Category: Resistors; Package / Case: 0603 [1608 Metric]; Tolerance: ±1%; Value: 3k; RoHS: RoHS Compliant; Composition: Thick Film; Features: -; Size / Dimension: 0.063" L x 0.031" W (1.60mm x 0.80mm); Height: 0.016" (0.40mm); Number of Terminations: 2
R7 = R0603-2k: RES, 2k, 1%, 0.063 W, 0603; Manufacturer Part Number: RE0603FRE072KL; Power (Watts): 0.063W, 1/16W; .Checked PCB: OK RF; .Checked SCH: RF; Category: Resistors; Package / Case: 0603 [1608 Metric]; Tolerance: ±1%; Value: 2k; RoHS: RoHS Compliant; Composition: Thick Film; Features: -; Size / Dimension: 0.063" L x 0.031" W (1.60mm x 0.80mm); Height: 0.016" (0.40mm); Number of Terminations: 2
R22#1 R26#1 R29 = R0402-1M: RES, 1M, 1%, 1/16 W, 0402; Manufacturer Part Number: RC0402FR-101ML; Power (Watts): 0.063W, 1/16W; .Checked PCB: OK RF; .Checked SCH: RF; Category: Resistors; Package / Case: 0402; Tolerance: ±1%; Value: 1M; RoHS: RoHS Compliant; Composition: Thick Film; Features: -; Size / Dimension: 0.039" L x 0.020" W (1.00mm x 0.50mm); Height: 0.016" (0.40mm); Number of Terminations: 2
R23#2 R25#1 = R0402-100k: RES, 100k, 1%, 1/16 W, 0402; Manufacturer Part Number: AC0402FR-13100KL; Power (Watts): 0.063W, 1/16W; .Checked PCB: OK RF; .Checked SCH: RF; Category: Resistors; Package / Case: 0402; Tolerance: ±1%; Value: 100k; RoHS: RoHS Compliant; Composition: Thick Film; Features: -; Size / Dimension: 0.039" L x 0.020" W (1.00mm x 0.50mm); Height: 0.016" (0.40mm); Number of Terminations: 2
R24#1 = R0402-1k: RES, 1k, 1%, 1/16 W, 0402; Power (Watts): 0.063W, 1/16W; .Checked PCB: OK RF; .Checked SCH: RF; Category: Resistors; Package / Case: 0402; Tolerance: ±1%; Value: 1k; RoHS: RoHS Compliant; Composition: Thick Film; Features: -; Size / Dimension: 0.039" L x 0.020" W (1.00mm x 0.50mm); Height: 0.016" (0.40mm); Number of Terminations: 2
R25#2 R48 = R0402-10k: RES, 10k, 1%, 1/16 W, 0402; Manufacturer Part Number: RE0402FRE0710KL; Power (Watts): 0.063W, 1/16W; .Checked PCB: OK RF; .Checked SCH: RF; Category: Resistors; Package / Case: 0402; Tolerance: ±1%; Value: 10k; RoHS: RoHS Compliant; Composition: Thick Film; Features: -; Size / Dimension: 0.039" L x 0.020" W (1.00mm x 0.50mm); Height: 0.016" (0.40mm); Number of Terminations: 2
R27 R28 = R0603-5k1: RES, 5k1, 1%, 0.063 W, 0603; Manufacturer Part Number: AC0603FR-135K1L; Power (Watts): 0.063W, 1/16W; .Checked PCB: OK RF; .Checked SCH: RF; Category: Resistors; Package / Case: 0603 [1608 Metric]; Tolerance: ±1%; Value: 5k1; RoHS: RoHS Compliant; Composition: Thick Film; Features: -; Size / Dimension: 0.063" L x 0.031" W (1.60mm x 0.80mm); Height: 0.016" (0.40mm); Number of Terminations: 2
R30 R31 = R0402-0R: RES, 0R, 1%, 1/16 W, 0402; Manufacturer Part Number: AC0402FR-070RL; Power (Watts): 0.063W, 1/16W; .Checked PCB: OK RF; .Checked SCH: RF; Category: Resistors; Package / Case: 0402; Tolerance: ±1%; Value: 0R; RoHS: RoHS Compliant; Composition: Thick Film; Features: -; Size / Dimension: 0.039" L x 0.020" W (1.00mm x 0.50mm); Height: 0.016" (0.40mm); Number of Terminations: 2
R47 = R0805-0.01R: RES, 10 mOhm, 1%, 1/8W, 0805; Manufacturer Part Number: RL0805FR-070R01L; Power (Watts): 0.125W, 1/8W; .Checked PCB: OK RF; .Checked SCH: RF; Category: Resistors; Package / Case: 0805 (2012 Metric); Tolerance: ±1%; Value: 0.01R; RoHS: RoHS Compliant; Composition: Thick Film; Features: -; Size / Dimension: 0.079" L x 0.049" W (2.00mm x 1.25mm); Height: 0.024" (0.60mm); Number of Terminations: 2